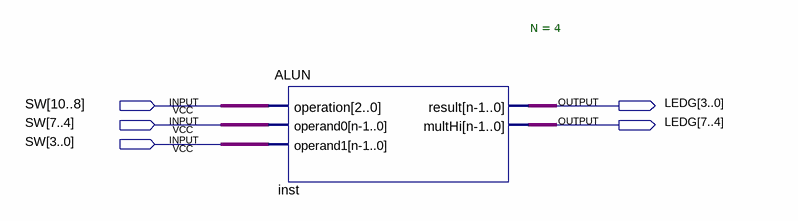
[diagram p0: schematic sheet]
// Quartus schematic ALUN_Demo.bdf as structural Verilog: 1 symbols, 5 pins
module ALUN_Demo (
  input  [10:0] SW,
  output [7:0] LEDG
);

  ALUN #(.N(4)) inst (
    .operation(SW[10:8]), .operand0(SW[7:4]), .operand1(SW[3:0]), .result(LEDG[3:0]), .multHi(LEDG[7:4]));
endmodule
